# Altium schematic sheet DAP Board V0.3.SchDoc
size A4; SheetNumber: 5; SheetTotal: 5
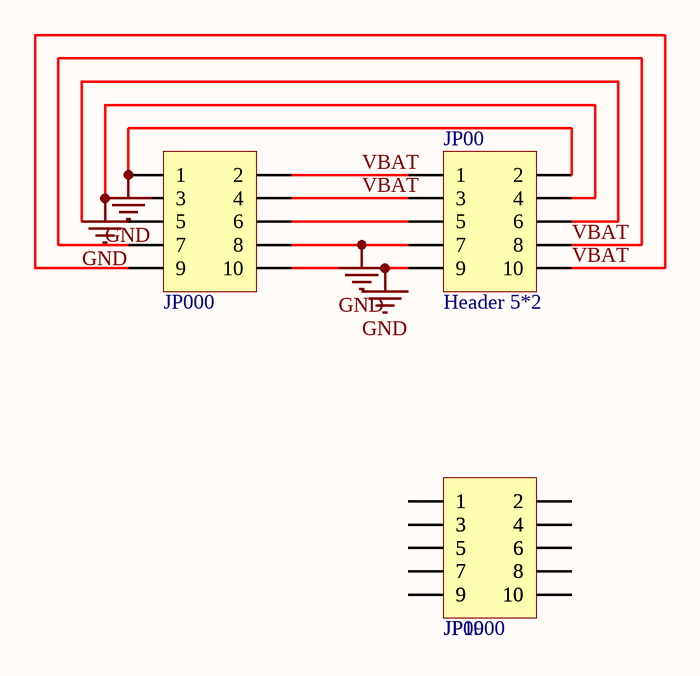
[diagram p0: DAP Board V0.3.SchDoc]

## Parts
JP00  Header 5*2  [BTB-0.8MM-SMD-BM-2*5PIN]
JP0000  Header 5X2  [HDR2.54-M-LS-2x5P]  (value not drawn)
JP000  Header 5X2  [HDR1.27-M-LS-2x5P]  (value not drawn)
JP19  Header 5X2  [HDR1.27-M-LS-2x5P]  (value not drawn)

## Nets
GND: JP000.1 JP00.2 JP000.3 JP00.4 JP00.7 JP000.8 JP00.9 JP000.10
VBAT: JP00.1 JP000.2 JP00.3 JP000.4 JP000.7 JP00.8 JP000.9 JP00.10
NetJP0000_1: JP0000.1 JP19.1
NetJP0000_2: JP0000.2 JP19.2
NetJP0000_3: JP0000.3 JP19.3
NetJP0000_4: JP0000.4 JP19.4
NetJP00_5: JP00.5 JP000.6
NetJP000_5: JP000.5 JP00.6
NetJP0000_5: JP0000.5 JP19.5
NetJP0000_6: JP0000.6 JP19.6
NetJP0000_7: JP0000.7 JP19.7
NetJP0000_8: JP0000.8 JP19.8
NetJP0000_9: JP0000.9 JP19.9
NetJP0000_10: JP0000.10 JP19.10

## Library data of the parts
JP00 = Header 5*2: BTB Connector
JP0000 JP000 JP19 = Header 5X2: 5*2P接插件; 版权归属: 封装库来自淘宝 ID：黄晶宝石; BOM名称: 5*2P接插件; 学习资源: https://shop463601444.taobao.com